# EAGLE design mini-joystick (EAGLE 6.1)
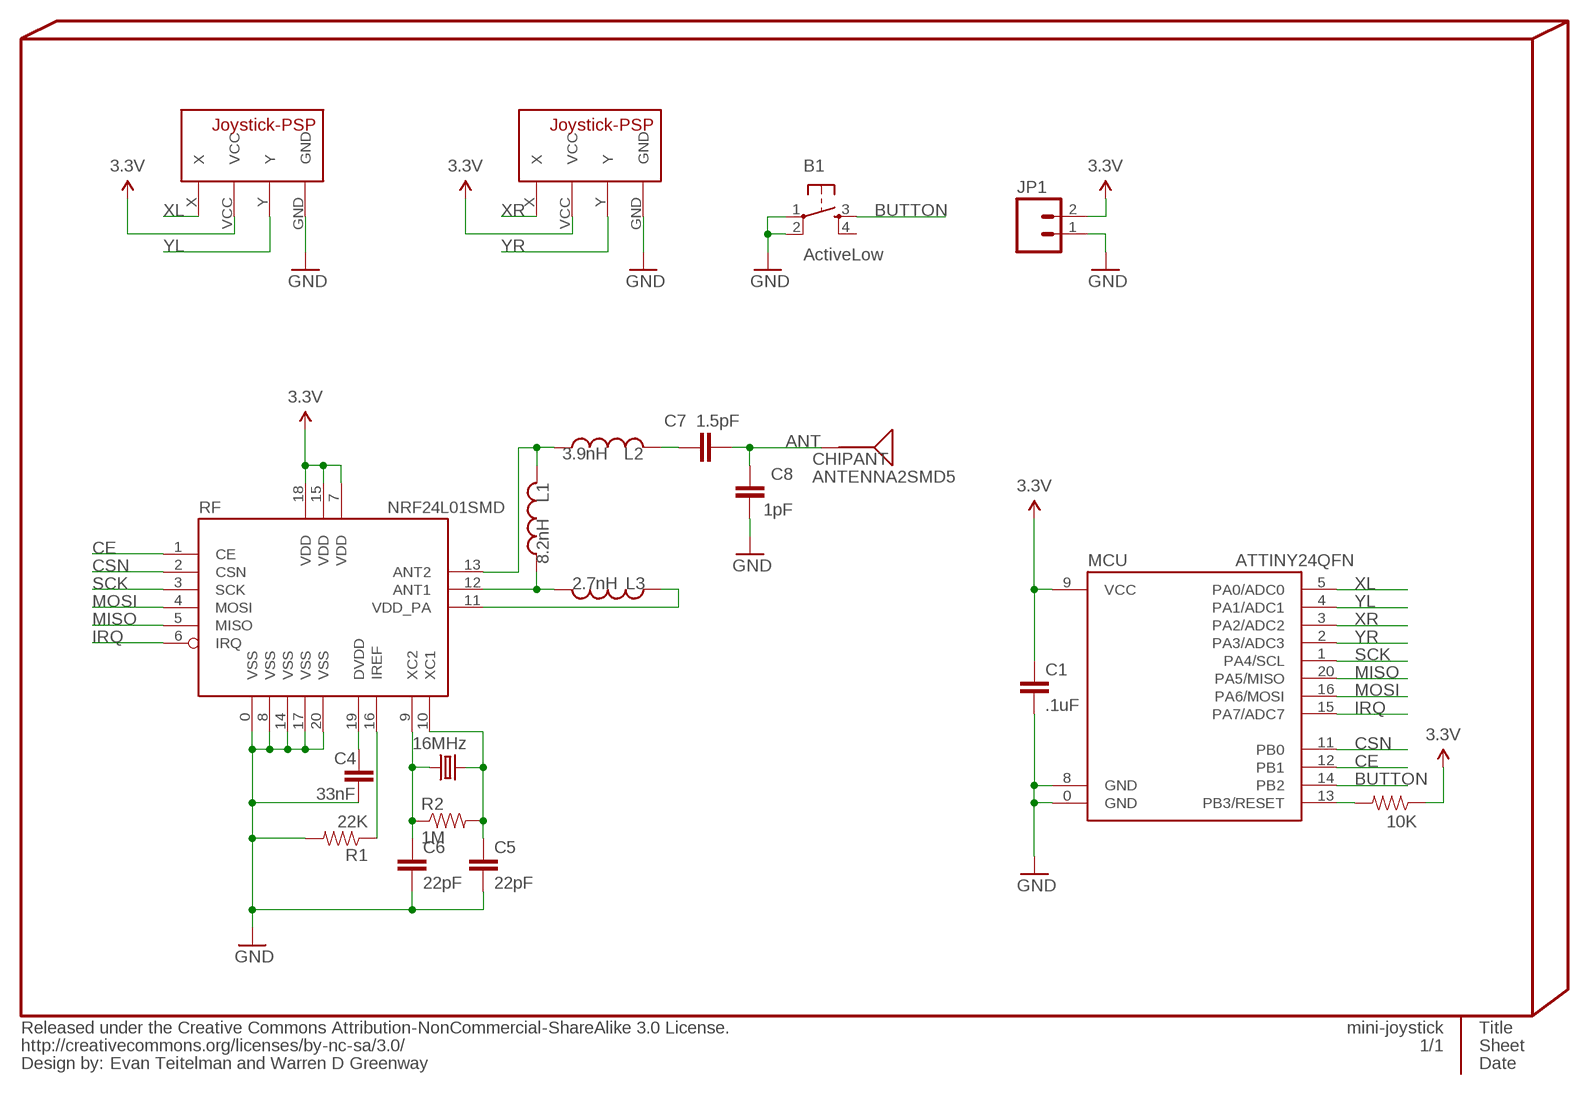
[diagram p0: schematic, sheet 1]

## Parts
B1  ActiveLow  TAC_SWITCHSMD  [TACTILE_SWITCH_SMD]
C1  .1uF  CAP0402-CAP  [0402-CAP]
C4  33nF  CAP0402-CAP  [0402-CAP]
C5  22pF  CAP0402-CAP  [0402-CAP]
C6  22pF  CAP0402-CAP  [0402-CAP]
C7  1.5pF  CAP0402-CAP  [0402-CAP]
C8  1pF  CAP0402-CAP  [0402-CAP]
CHIPANT  ANTENNA2SMD5  [ANTENNA-CHIP5]
INFO4  Evan Teitelman and Warren D Greenway  %CC-NC-SA  [%CC-NC-SA]
JOYSTICK_LEFT  JOYSTICK-PSP1000NOHOLES  [JOYSTICK-PSP1000NH_]
JOYSTICK_RIGHT  JOYSTICK-PSP1000NOHOLES  [JOYSTICK-PSP1000NH_]
JP1  M02-JST-2MM-SMT  [JST-2-SMD]
L1  8.2nH  INDUCTOR0402  [C0402]
L2  3.9nH  INDUCTOR0402  [C0402]
L3  2.7nH  INDUCTOR0402  [C0402]
MCU  ATTINY24QFN  [QFN20]
R1  22K  RESISTOR0603-RES  [0603-RES]
R2  1M  RESISTOR0603-RES  [0603-RES]
R3  10K  RESISTOR0402-RES  [0402-RES]
RF  NRF24L01SMD  [QFN20]
Y1  16MHz  CRYSTAL5X3  [CRYSTAL-SMD-5X3]

## Nets
3.3V: C1.1 JOYSTICK_LEFT.VCC JOYSTICK_RIGHT.VCC JP1.2 MCU.9(VCC) R3.1 RF.7(VDD) RF.15(VDD) RF.18(VDD) ; supply symbol labelled @3.3V
ANT: C7.2 C8.2 CHIPANT.FEED(SIGNAL)
ANT1: L1.1 L3.2 RF.12(ANT1)
ANT2: L1.2 L2.1 RF.13(ANT2)
BUTTON: B1.3 MCU.14(PB2)
CE: MCU.12(PB1) RF.1(CE)
CSN: MCU.11(PB0) RF.2(CSN)
DVDD: C4.1 RF.19(DVDD)
GND: B1.1 B1.2 C1.2 C4.2 C5.2 C6.2 C8.1 JOYSTICK_LEFT.GND JOYSTICK_RIGHT.GND JP1.1 MCU.0(GND) MCU.8(GND) R1.2 RF.0(VSS) RF.8(VSS) RF.14(VSS) RF.17(VSS) RF.20(VSS) ; supply symbol labelled @GND
IREF: R1.1 RF.16(IREF)
IRQ: MCU.15(PA7/ADC7) RF.6(IRQ)
MISO: MCU.20(PA5/MISO) RF.5(MISO)
MOSI: MCU.16(PA6/MOSI) RF.4(MOSI)
N$1: C7.1 L2.2
RESET: MCU.13(PB3/RESET) R3.2
SCK: MCU.1(PA4/SCL) RF.3(SCK)
VDD_PA: L3.1 RF.11(VDD_PA)
XC1: C5.1 R2.2 RF.10(XC1) Y1.3
XC2: C6.1 R2.1 RF.9(XC2) Y1.1
XL: JOYSTICK_LEFT.X MCU.5(PA0/ADC0)
XR: JOYSTICK_RIGHT.X MCU.3(PA2/ADC2)
YL: JOYSTICK_LEFT.Y MCU.4(PA1/ADC1)
YR: JOYSTICK_RIGHT.Y MCU.2(PA3/ADC3)
Unconnected: B1.4

## Library data of the parts
B1 = SparkFun:TAC_SWITCH: Momentary Switch Button commonly used for reset or general input. Spark Fun Electronics SKU : COM-00097
C1 C4-C8 = SparkFun:CAP: Capacitor Standard 0603 ceramic capacitor, and 0.1" leaded capacitor.
CHIPANT = SparkFun:ANTENNA2: Antenna Single endded antenna. Common with smaller chip antennas. CHIP4 package is the GPS Chip Antenna SKU: GPS-08418. CHIP5 package is 2.4GHz chip antenna SKU: WRL-00144.
INFO4 = PygmyBoards:%CC-NC-SA: Released under the Creative Commons Attribution-NonCommercial-ShareAlike 3.0 License. http://creativecommons.org/licenses/by-sa/3.0 Design by: [Designer Name] Change this part's value to change the designer name
JOYSTICK_LEFT JOYSTICK_RIGHT = EagleLbr:JOYSTICK-PSP1000: This is a footprint for the PSP-1000 Joystick. 4-pins: X, Y, Vcc and GND
JP1 = SparkFun:M02: Header 2 Standard 2-pin 0.1" header. Use with straight break away headers (SKU : PRT-00116), right angle break away headers (PRT-00553), swiss pins (PRT-00743), machine pins (PRT-00117), and female headers (PRT-00115). Molex polarized connector foot print use with SKU : PRT-08233 with associated crimp pins and housings.
L1-L3 = SparkFun:INDUCTOR: Inductors Basic Inductor/Choke - 0603 and 1206. Footprints are not proven and vary greatly between part numbers.
MCU = SparkFun:ATTINY24
R1-R3 = SparkFun:RESISTOR: Resistor Basic schematic elements and footprints for 0603, 1206, and PTH resistors.
RF = SparkFun:NRF24L01: 2.4GHz Low Power Transceiver This is the very popular, low cost, very low power RF transceiver from Nordic Semiconductor. Simple SPI interface. SKU: COM-00690
Y1 = SparkFun:CRYSTAL: Crystals Various standard crystals. Proven footprints. Spark Fun Electronics SKU : COM-00534

## Board
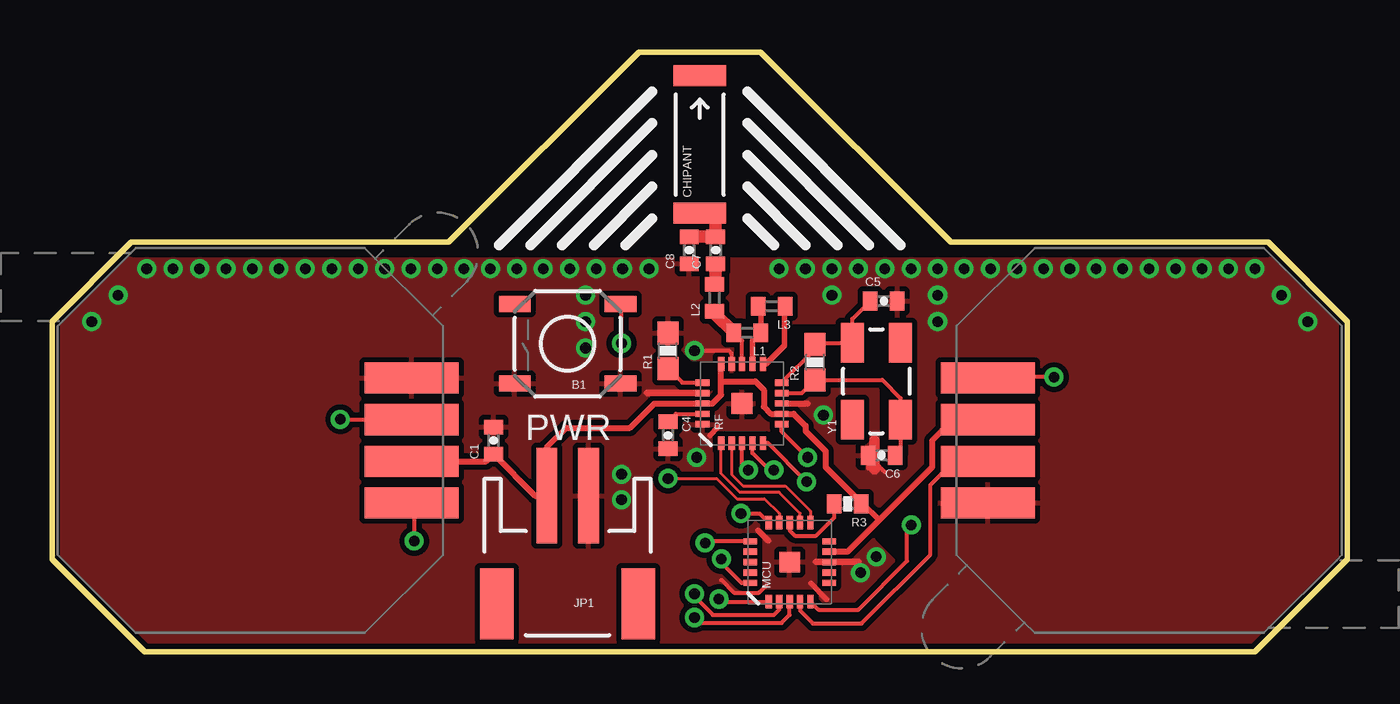
[diagram p1: board, top side]
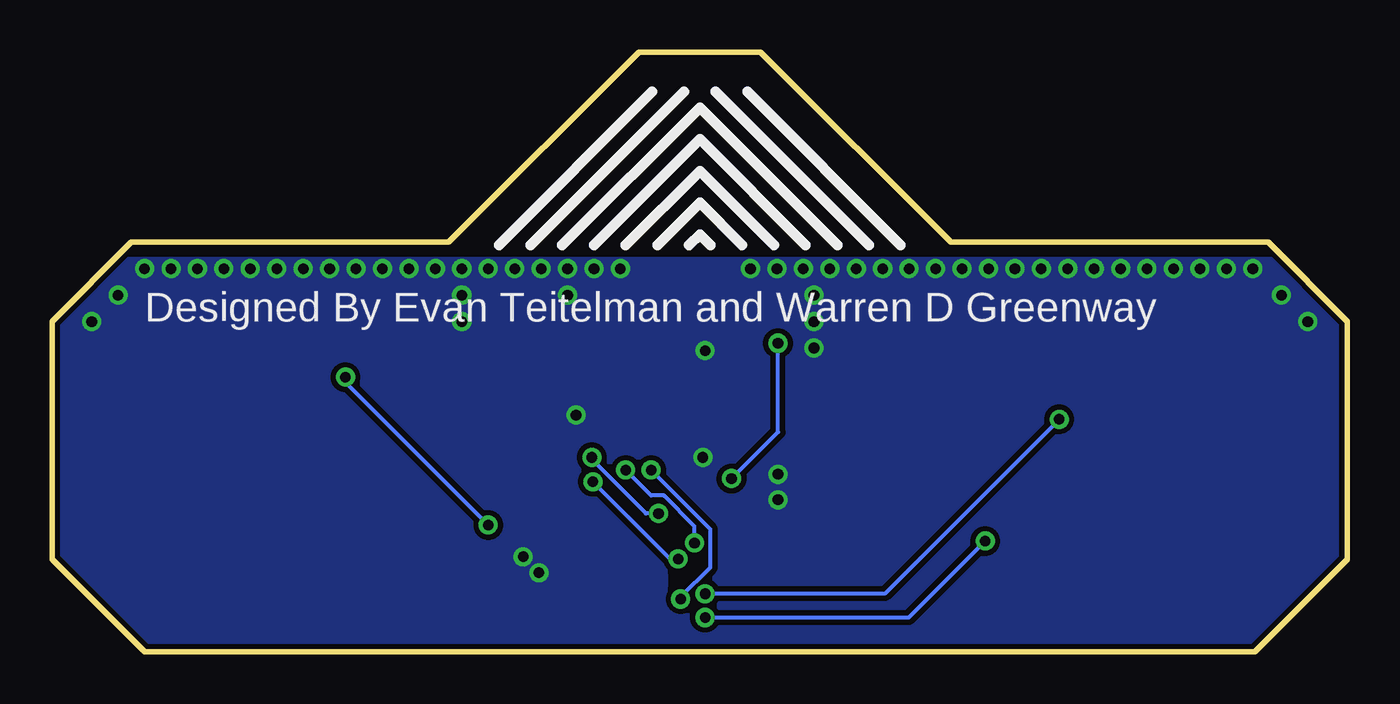
[diagram p2: board, bottom side, seen from below]

Size 62.23 x 28.83 mm. Coordinates in mm from the lower left corner, seen from the top.
Outline: 57.78,0 62.23,4.45 62.23,15.88 58.42,19.69 43.18,19.69 34.04,28.83 28.19,28.83 19.05,19.69 3.81,19.69 0,15.88 0,4.45 4.45,0 57.78,0
Copper layers (1*16): Top 0.035mm / dielectric 1.5mm / Bottom 0.035mm
Design rules: minimum track width 6mil, minimum drill 15mil, track to track 6mil, track to pad 6mil, pad to pad 4mil, via to via 6mil, smd to smd 4mil, copper to edge 10mil, drill to drill 6mil, minimum pad ring 10mil, minimum via ring 8mil, stop-mask expansion 4mil, vias tented up to drill 25mil, thermal gap 10mil
tRestrict: 8 lines
bRestrict: 2 lines

### Footprints (pad centres in the part's own frame; a part is rotated, then mirrored left to right if it is on the bottom)
TACTILE_SWITCH_SMD = smd 1.524 x 0.762: 1 -2.54,1.905; 2 2.54,1.905; 3 -2.54,-1.905; 4 2.54,-1.905
0402-CAP = smd 0.7 x 0.9: 1 -0.65,0; 2 0.65,0
ANTENNA-CHIP5 = smd 1.016 x 2.54: FEED -3.302,0; NC 3.302,0
JOYSTICK-PSP1000NH_ = smd 1.5 x 4.5: GND -3,7.75; VCC 1,7.75; X 3,7.75; Y -1,7.75
JST-2-SMD = smd 1 x 4.6: 1 -1,-3.7; 2 1,-3.7 | smd 1.6 x 3.4: NC1 -3.4,1.5; NC2 3.4,1.5
C0402 = smd 0.7 x 0.9: 1 -0.65,0; 2 0.65,0
QFN20 = smd 1 x 1: 0 0,0 | smd 0.65 x 0.3: 1 -1.9,1; 2 -1.9,0.5; 3 -1.9,0; 4 -1.9,-0.5; 5 -1.9,-1; 11 1.9,-1; 12 1.9,-0.5; 13 1.9,0; 14 1.9,0.5; 15 1.9,1 | smd 0.3 x 0.65: 6 -1,-1.9; 7 -0.5,-1.9; 8 0,-1.9; 9 0.5,-1.9; 10 1,-1.9; 16 1,1.9; 17 0.5,1.9; 18 0,1.9; 19 -0.5,1.9; 20 -1,1.9
0603-RES = smd 1.1 x 1: 1 -0.85,0; 2 0.85,0
0402-RES = smd 0.7 x 0.9: 1 -0.65,0; 2 0.65,0
CRYSTAL-SMD-5X3 = smd 1.9 x 1.1: 1 -1.85,-1.15; 2 1.85,-1.15; 3 1.85,1.15; 4 -1.85,1.15

### Placement (x,y rotation side)
B1  24.77,14.81 180 top
C1  21.21,10.16 90 top
C4  29.59,10.41 270 top
C5  39.95,16.87 0 top
C6  39.85,9.45 180 top
C7  31.88,19.3 90 top
C8  30.61,19.3 90 top
CHIPANT  31.12,24.38 90 top
INFO4  -4.45,-9.86 0 top  (outside the outline)
JOYSTICK_LEFT  52.7,10.16 90 top
JOYSTICK_RIGHT  9.53,10.16 270 top
JP1  24.77,3.81 180 top
L1  33.4,15.34 180 top
L2  31.83,17.02 90 top
L3  34.57,16.61 180 top
MCU  35.43,4.32 90 top
R1  29.59,14.48 90 top
R2  36.65,13.92 90 top
R3  38.23,7.11 180 top
RF  33.15,11.94 90 top
Y1  39.6,13 90 top

### Tracks (layer width: path | path; a pad name or v marks a point on that pad's centre or on a via)
3.3V
  Top 0.203: R3.1 38.94,7.11 38.96,7.09
  Top 0.292: JOYSTICK_RIGHT.VCC 20.86,9.16 C1.1 23.21,7.51 JP1.2 23.77,9.82 24.71,10.77 27.76,10.77 28.93,11.94 RF.18 31.73,11.94 32.15,12.36 32.15,12.95 | 43.29,11.16 42.29,10.16 42.29,8.89 39.69,6.29 38.22,4.82 MCU.9 | 32.15,12.95 RF.15 | 32.15,12.95 32.2,13 33.78,13 34.19,12.6 34.19,11.79 34.54,11.44 RF.7 35.63,11.44 36.2,10.87 36.2,10.62 37.16,9.65 37.16,8.89 38.96,7.09 39.69,6.36
  Top 0.305: 43.29,11.16 JOYSTICK_LEFT.VCC | 39.69,6.36 39.69,6.29
ANT
  Top 0.61: C8.2 C7.2 31.88,21.08 CHIPANT.FEED
ANT1
  Top 0.254: RF.12 33.65,14.94 L1.1 34.05,16.48 L3.2
ANT2
  Top 0.203: RF.13 33.15,14.95 L1.2
  Top 0.61: L1.2 31.83,16.27 L2.1
BUTTON  (via drill 0.51)
  Top 0.152: MCU.14 34.93,6.65 34.21,7.37 32.89,7.37 31.93,8.33 v29.59,8.33
  Top 0.203: v27.36,14.83 27.36,16.66 B1.3
  Bottom 0.203: v27.36,14.83 27.36,10.57 v29.59,8.33
CE
  Top 0.152: MCU.12 35.93,6.66 34.92,7.67 33.05,7.67 32.15,8.57 RF.1
CSN
  Top 0.152: MCU.11 36.43,6.77 35.23,7.98 33.2,7.98 32.65,8.53 RF.2
DVDD
  Top 0.203: C4.1 29.96,11.44 RF.19
GND  (via drill 0.51)
  Top 0.203: RF.14 32.65,14.34 32.51,14.48 v30.86,14.48 | C6.2 39.2,8.8 39.5,9.1 39.5,9.14 40.01,8.64 | 32.16,3.45 32.77,2.84 33.96,2.84 34.31,3.2
  Top 0.254: 31.6,10.41 31.98,10.8 | 37.21,2.54 36.45,3.3 | 34.42,5.33 33.91,5.84
  Top 0.292: 34.92,11.94 36.3,11.94
  Top 0.305: 36.7,4.32 38.73,4.32 | 28.58,12.45 31.37,12.45
  Top 0.508: 39.5,8.76 39.5,9.14 39.5,10.16
  other vias: 37.06,11.38 39.6,4.57 27.36,8.53 27.36,7.32 38.84,3.81 57.78,18.41 56.52,18.41 55.24,18.41 53.98,18.41 52.7,18.41 51.44,18.41 50.16,18.41 48.9,18.41 47.62,18.41 46.35,18.41 45.09,18.41 43.81,18.41 42.55,18.41 41.27,18.41 40.01,18.41 38.73,18.41 37.46,18.41 36.2,18.41 28.68,18.41 27.41,18.41 26.14,18.41 24.87,18.41 23.6,18.41 22.33,18.41 21.06,18.41 19.79,18.41 18.52,18.41 17.25,18.41 15.98,18.41 14.71,18.41 13.44,18.41 12.17,18.41 10.9,18.41 9.63,18.41 8.36,18.41 7.09,18.41 5.82,18.41 4.55,18.41 59.05,17.14 60.32,15.88 3.17,17.14 1.9,15.88 34.92,18.41 37.46,17.14 30.96,9.35 25.63,15.88 25.63,17.14 25.63,14.61 42.55,17.14 42.55,15.88
  pour Top (isolate 0.254): -3.18,30.48 65.41,30.48 65.41,-1.27 -3.18,-1.27
  pour Bottom (isolate 0.254): -4.45,-2.54 -4.45,31.75 66.68,31.75 66.68,-2.54
IREF
  Top 0.203: RF.16 30.28,12.94 R1.1
IRQ  (via drill 0.51)
  Top 0.152: MCU.15 34.35,6.3
  Top 0.203: v36.3,9.35 35.05,10.6 RF.6 | v33.1,6.66 34,6.66 MCU.15
  Bottom 0.152: 36.3,9.25 v36.3,9.35
  Bottom 0.203: 36.3,9.25 33.71,6.66 v33.1,6.66
MISO  (via drill 0.51)
  Top 0.152: 34.18,10.04 RF.5 34.34,10.04
  Top 0.203: v36.25,8.18 34.39,10.04 RF.5 | MCU.20 33.13,3.32 32.16,4.29 v32.16,4.47
  Bottom 0.203: v32.16,4.47 32.54,4.47 v36.25,8.18
MOSI  (via drill 0.51)
  Top 0.203: RF.4 33.65,9.56 34.47,8.74 v34.67,8.74 | MCU.16 31.45,5.32 v31.37,5.23
  Bottom 0.203: v34.67,8.74 33.45,7.52 32.84,7.52 31.37,6.05 v31.37,5.23
N$1
  Top 0.254: L2.2 31.88,17.72
  Top 0.61: 31.88,17.72 C7.1
RESET
  Top 0.203: MCU.13 35.43,5.84 35.69,5.59 36.7,5.59 37.58,6.46 R3.2
SCK  (via drill 0.51)
  Top 0.203: RF.3 33.15,9.04 v33.45,8.74 | MCU.1 32.15,2.42 v32.03,2.54
  Bottom 0.152: v32.03,2.54 32.03,2.64
  Bottom 0.203: v33.45,8.74 30.61,5.89 30.61,4.06 32.03,2.64
VDD_PA
  Top 0.254: RF.11 34.28,13.84 35.18,14.73 35.18,16.57 L3.1
XC1
  Top 0.203: RF.10 36.65,14.54 R2.2 36.74,14.86 Y1.3 38.45,16.01 C5.1
XC2
  Top 0.152: 40.75,9.44 40.74,9.45
  Top 0.203: RF.9 36.02,12.44 R2.1 39.89,13.07 40.77,12.19 40.77,11.17 Y1.1 40.75,9.44 | 40.74,9.45 C6.1
XL  (via drill 0.51)
  Top 0.203: MCU.5 36.82,2.03 38.73,2.03 41.07,4.37 41.07,5.89 v41.27,6.1 | JOYSTICK_LEFT.X 45,13.21 v48.13,13.21
  Bottom 0.203: v41.27,6.1 48.13,12.95 v48.13,13.21
XR  (via drill 0.51)
  Top 0.152: JOYSTICK_RIGHT.X 17.4,7.04
  Top 0.203: MCU.3 35.43,1.78 35.05,1.4 31.12,1.4 v30.86,1.65 | 17.4,7.04 v17.4,5.33
  Bottom 0.203: v30.86,1.65 21.08,1.65 v17.4,5.33
YL
  Top 0.203: MCU.4 35.93,1.99 36.55,1.37 38.89,1.37 42.19,4.67 42.19,8.03 43.32,9.16 JOYSTICK_LEFT.Y
YR  (via drill 0.51)
  Top 0.152: 17.26,11.18 JOYSTICK_RIGHT.Y
  Top 0.203: MCU.2 34.93,2.04 34.67,1.78 31.75,1.78 30.86,2.67 v30.86,2.79 | v13.84,11.18 17.26,11.18
  Bottom 0.203: v30.86,2.79 22.23,2.79 v13.84,11.18

### Text on the board
_tsilk: PWR
_bsilk: Designed By Evan Teitelman and Warren D Greenway
_tNames: CHIPANT | L2 | C7 | C5 | C8 | L1 | L3 | R1 | B1 | R2 | C4 | RF | Y1 | C1 | C6 | JP1 | MCU